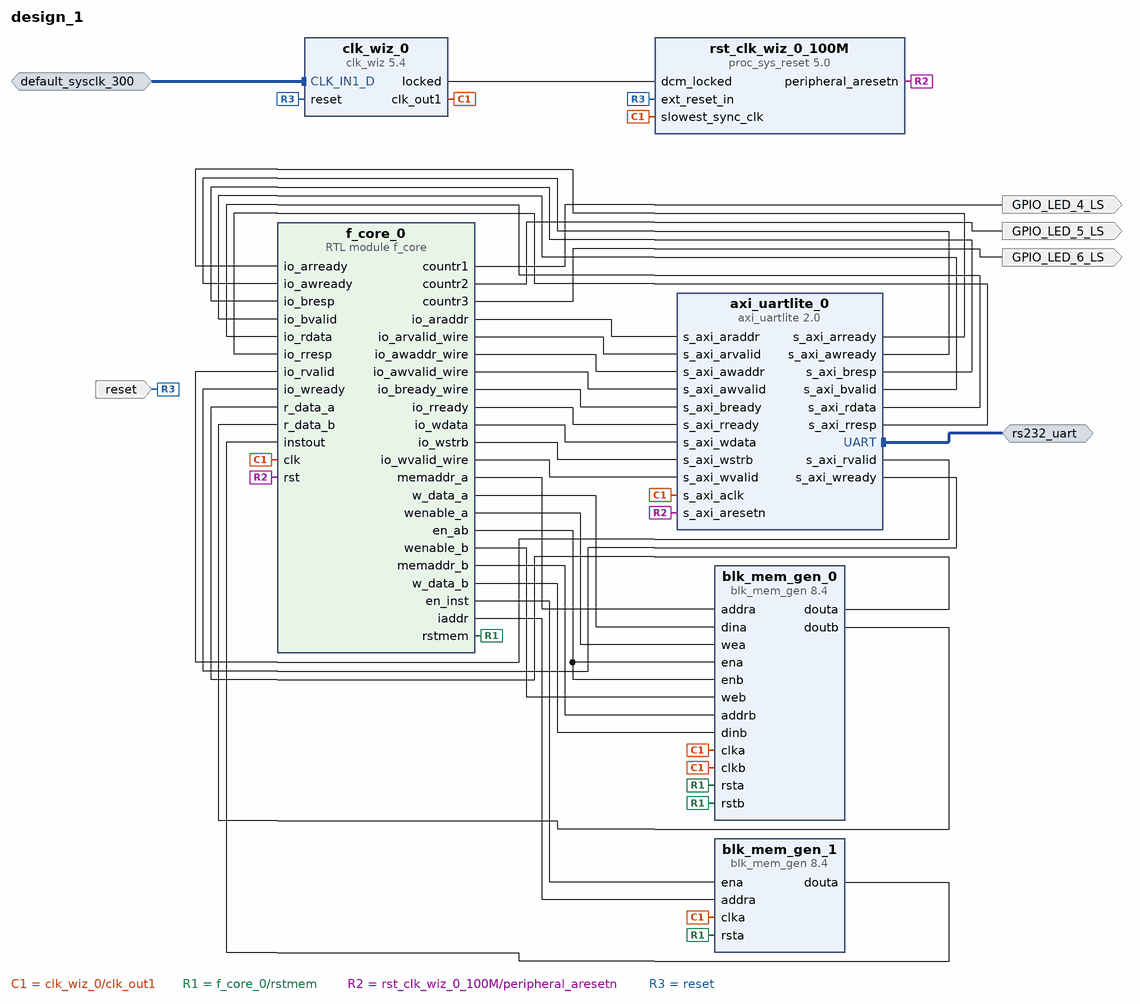
[diagram p0: block diagram of the top level]
# Vivado block design design_1, xcku040-ffva1156-2-e, Vivado 2017.4
create_bd_design design_1

create_bd_intf_port -mode Slave -vlnv xilinx.com:interface:diff_clock_rtl:1.0 default_sysclk_300
set_property -dict {CONFIG.FREQ_HZ 300000000} [get_bd_intf_ports default_sysclk_300]
create_bd_intf_port -mode Master -vlnv xilinx.com:interface:uart_rtl:1.0 rs232_uart
create_bd_port -dir I -type rst reset
set_property -dict {CONFIG.POLARITY ACTIVE_HIGH} [get_bd_ports reset]
create_bd_port -dir O -type data GPIO_LED_4_LS
create_bd_port -dir O -type data GPIO_LED_5_LS
create_bd_port -dir O -type data GPIO_LED_6_LS

create_bd_cell -type ip -vlnv xilinx.com:ip:axi_uartlite:2.0 axi_uartlite_0
set_property -dict {CONFIG.USE_BOARD_FLOW true CONFIG.UARTLITE_BOARD_INTERFACE rs232_uart} [get_bd_cells axi_uartlite_0]
create_bd_cell -type ip -vlnv xilinx.com:ip:blk_mem_gen:8.4 blk_mem_gen_0
set_property -dict [list \
  CONFIG.Memory_Type True_Dual_Port_RAM \
  CONFIG.Enable_B Use_ENB_Pin \
  CONFIG.Use_RSTB_Pin true \
  CONFIG.Port_B_Clock 100 \
  CONFIG.Port_B_Write_Rate 50 \
  CONFIG.Port_B_Enable_Rate 100 \
  CONFIG.EN_SAFETY_CKT false \
] [get_bd_cells blk_mem_gen_0]
create_bd_cell -type ip -vlnv xilinx.com:ip:blk_mem_gen:8.4 blk_mem_gen_1
set_property -dict [list \
  CONFIG.Memory_Type Single_Port_ROM \
  CONFIG.Load_Init_File true \
  CONFIG.Coe_File ../../../../../../../inst.coe \
  CONFIG.Port_A_Write_Rate 0 \
  CONFIG.EN_SAFETY_CKT false \
] [get_bd_cells blk_mem_gen_1]
create_bd_cell -type module -reference f_core f_core_0
create_bd_cell -type ip -vlnv xilinx.com:ip:clk_wiz:5.4 clk_wiz_0
set_property -dict [list \
  CONFIG.USE_BOARD_FLOW true \
  CONFIG.CLK_IN1_BOARD_INTERFACE default_sysclk_300 \
  CONFIG.RESET_BOARD_INTERFACE reset \
] [get_bd_cells clk_wiz_0]
create_bd_cell -type ip -vlnv xilinx.com:ip:proc_sys_reset:5.0 rst_clk_wiz_0_100M
set_property -dict {CONFIG.USE_BOARD_FLOW true CONFIG.RESET_BOARD_INTERFACE reset} [get_bd_cells rst_clk_wiz_0_100M]

# ---- connections ----

connect_bd_intf_net -intf_net default_sysclk_300_1 [get_bd_intf_ports default_sysclk_300] [get_bd_intf_pins clk_wiz_0/CLK_IN1_D]
connect_bd_intf_net [get_bd_intf_ports rs232_uart] [get_bd_intf_pins axi_uartlite_0/UART]
connect_bd_net -net f_core_all_0_clk [get_bd_pins clk_wiz_0/clk_out1] \
  [get_bd_pins axi_uartlite_0/s_axi_aclk] [get_bd_pins blk_mem_gen_0/clka] [get_bd_pins blk_mem_gen_0/clkb] \
  [get_bd_pins blk_mem_gen_1/clka] [get_bd_pins f_core_0/clk] [get_bd_pins rst_clk_wiz_0_100M/slowest_sync_clk]
connect_bd_net [get_bd_pins f_core_0/io_araddr] [get_bd_pins axi_uartlite_0/s_axi_araddr]
connect_bd_net [get_bd_pins axi_uartlite_0/s_axi_arready] [get_bd_pins f_core_0/io_arready]
connect_bd_net [get_bd_pins f_core_0/io_arvalid_wire] [get_bd_pins axi_uartlite_0/s_axi_arvalid]
connect_bd_net [get_bd_pins f_core_0/io_awaddr_wire] [get_bd_pins axi_uartlite_0/s_axi_awaddr]
connect_bd_net [get_bd_pins axi_uartlite_0/s_axi_awready] [get_bd_pins f_core_0/io_awready]
connect_bd_net [get_bd_pins f_core_0/io_awvalid_wire] [get_bd_pins axi_uartlite_0/s_axi_awvalid]
connect_bd_net [get_bd_pins f_core_0/io_bready_wire] [get_bd_pins axi_uartlite_0/s_axi_bready]
connect_bd_net [get_bd_pins axi_uartlite_0/s_axi_bresp] [get_bd_pins f_core_0/io_bresp]
connect_bd_net [get_bd_pins axi_uartlite_0/s_axi_bvalid] [get_bd_pins f_core_0/io_bvalid]
connect_bd_net [get_bd_pins axi_uartlite_0/s_axi_rdata] [get_bd_pins f_core_0/io_rdata]
connect_bd_net [get_bd_pins f_core_0/io_rready] [get_bd_pins axi_uartlite_0/s_axi_rready]
connect_bd_net [get_bd_pins axi_uartlite_0/s_axi_rresp] [get_bd_pins f_core_0/io_rresp]
connect_bd_net [get_bd_pins axi_uartlite_0/s_axi_rvalid] [get_bd_pins f_core_0/io_rvalid]
connect_bd_net [get_bd_pins f_core_0/io_wdata] [get_bd_pins axi_uartlite_0/s_axi_wdata]
connect_bd_net [get_bd_pins axi_uartlite_0/s_axi_wready] [get_bd_pins f_core_0/io_wready]
connect_bd_net [get_bd_pins f_core_0/io_wstrb] [get_bd_pins axi_uartlite_0/s_axi_wstrb]
connect_bd_net [get_bd_pins f_core_0/io_wvalid_wire] [get_bd_pins axi_uartlite_0/s_axi_wvalid]
connect_bd_net [get_bd_pins f_core_0/memaddr_a] [get_bd_pins blk_mem_gen_0/addra]
connect_bd_net [get_bd_pins f_core_0/w_data_a] [get_bd_pins blk_mem_gen_0/dina]
connect_bd_net [get_bd_pins f_core_0/wenable_a] [get_bd_pins blk_mem_gen_0/wea]
connect_bd_net [get_bd_pins f_core_0/en_ab] [get_bd_pins blk_mem_gen_0/ena] [get_bd_pins blk_mem_gen_0/enb]
connect_bd_net [get_bd_pins f_core_0/wenable_b] [get_bd_pins blk_mem_gen_0/web]
connect_bd_net [get_bd_pins blk_mem_gen_0/douta] [get_bd_pins f_core_0/r_data_a]
connect_bd_net [get_bd_pins f_core_0/memaddr_b] [get_bd_pins blk_mem_gen_0/addrb]
connect_bd_net [get_bd_pins f_core_0/w_data_b] [get_bd_pins blk_mem_gen_0/dinb]
connect_bd_net [get_bd_pins blk_mem_gen_0/doutb] [get_bd_pins f_core_0/r_data_b]
connect_bd_net [get_bd_pins f_core_0/en_inst] [get_bd_pins blk_mem_gen_1/ena]
connect_bd_net [get_bd_pins blk_mem_gen_1/douta] [get_bd_pins f_core_0/instout]
connect_bd_net [get_bd_pins f_core_0/iaddr] [get_bd_pins blk_mem_gen_1/addra]
connect_bd_net [get_bd_pins f_core_0/rstmem] [get_bd_pins blk_mem_gen_1/rsta] [get_bd_pins blk_mem_gen_0/rstb] [get_bd_pins blk_mem_gen_0/rsta]
connect_bd_net [get_bd_pins clk_wiz_0/locked] [get_bd_pins rst_clk_wiz_0_100M/dcm_locked]
connect_bd_net [get_bd_pins rst_clk_wiz_0_100M/peripheral_aresetn] [get_bd_pins axi_uartlite_0/s_axi_aresetn] [get_bd_pins f_core_0/rst]
connect_bd_net [get_bd_ports reset] [get_bd_pins clk_wiz_0/reset] [get_bd_pins rst_clk_wiz_0_100M/ext_reset_in]
connect_bd_net [get_bd_pins f_core_0/countr1] [get_bd_ports GPIO_LED_4_LS]
connect_bd_net [get_bd_pins f_core_0/countr2] [get_bd_ports GPIO_LED_5_LS]
connect_bd_net [get_bd_pins f_core_0/countr3] [get_bd_ports GPIO_LED_6_LS]

validate_bd_design
save_bd_design
